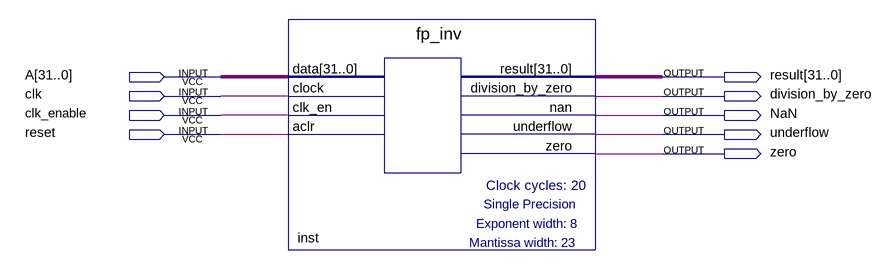
[diagram p0: schematic sheet]
// Quartus schematic fp_inv.bdf as structural Verilog: 1 symbols, 9 pins
module fp_inv (
  input  [31:0] A,
  input  clk,
  input  clk_enable,
  input  reset,
  output [31:0] result,
  output division_by_zero,
  output NaN,
  output underflow,
  output zero
);

  fp_inv inst (
    .data(A), .clock(clk), .clk_en(clk_enable), .aclr(reset), .result(result),
    .division_by_zero(division_by_zero), .nan(NaN), .underflow(underflow), .zero(zero));
endmodule
